# Altium project Terminal Shim Board.PrjPcb
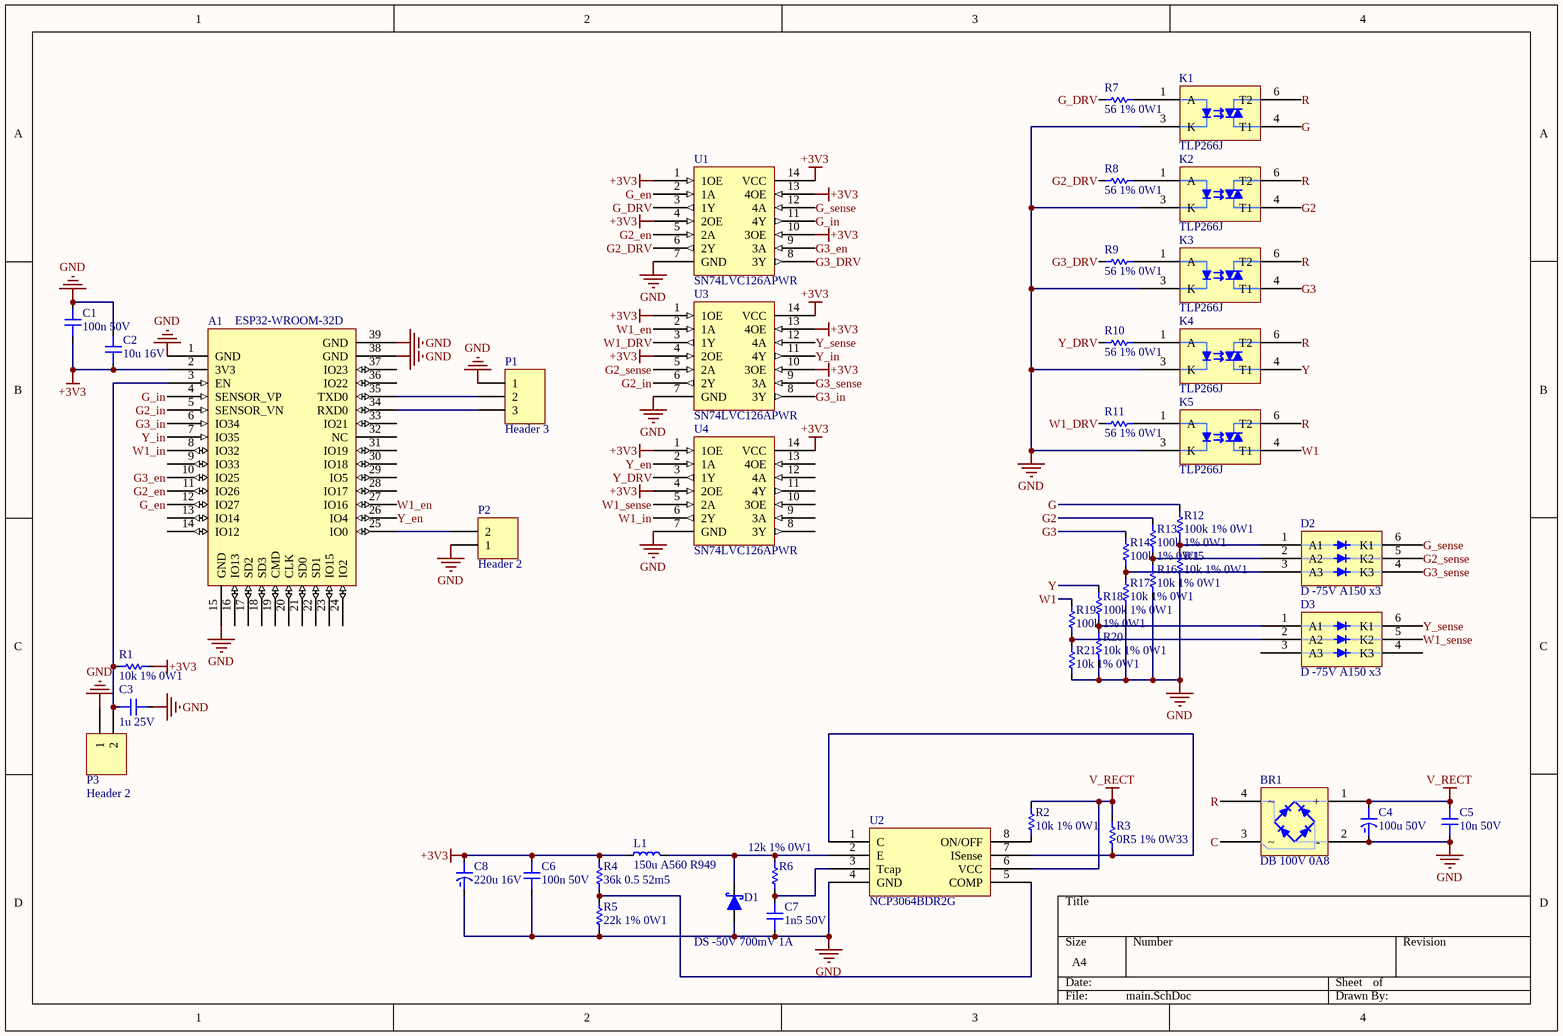
[diagram p0: main.SchDoc]
1 sheet, 47 parts. Net scope: strictly hierarchical (ports join the sheet entries above them; power ports are local).
Board file: main.PcbDoc

## Sheet main.SchDoc
size A4; SheetNumber: 1; SheetTotal: 1

### Parts
A1  ESP32-WROOM-32D  [ESP32-WROOM-32D]
BR1  DB 100V 0A8  [miniDIP 4]
C1  100n 50V  [CAP 0603 HD]
C2  10u 16V  [CAP 0805 LD]
C3  1u 25V  [CAP 0603 MD]
C4  100u 50V  [ELECTROLYTIC CAP D8 Lifted]
C5  10n 50V  [CAP 0603 HD]
C6  100n 50V  [CAP 0603 HD]
C7  1n5 50V  [CAP 0603 HD]
C8  220u 16V  [ELECTROLYTIC CAP D6.3 Lifted]
D1  DS -50V 700mV 1A  [DO-214AC]
D2  D -75V A150 x3  [SOT-363]
D3  D -75V A150 x3  [SOT-363]
K1  TLP266J  [11-4M1S MD]
K2  TLP266J  [11-4M1S MD]
K3  TLP266J  [11-4M1S MD]
K4  TLP266J  [11-4M1S MD]
K5  TLP266J  [11-4M1S MD]
L1  150u A560 R949  [IND 5050X45 MD]
P1  Header 3  [HDR1X3]
P2  Header 2  [HDR1X2]
P3  Header 2  [HDR1X2]
R1  10k 1% 0W1  [RES 0603 MD]
R2  10k 1% 0W1  [RES 0603 MD]
R3  0R5 1% 0W33  [RES 0805 HD]
R4  36k 0.5 52m5  [RES 0603 HD]
R5  22k 1% 0W1  [RES 0603 HD]
R6  12k 1% 0W1  [RES 0603 HD]
R7  56 1% 0W1  [RES 0603 HD]
R8  56 1% 0W1  [RES 0603 HD]
R9  56 1% 0W1  [RES 0603 HD]
R10  56 1% 0W1  [RES 0603 HD]
R11  56 1% 0W1  [RES 0603 HD]
R12  100k 1% 0W1  [RES 0603 HD]
R13  100k 1% 0W1  [RES 0603 HD]
R14  100k 1% 0W1  [RES 0603 HD]
R15  10k 1% 0W1  [RES 0603 HD]
R16  10k 1% 0W1  [RES 0603 HD]
R17  10k 1% 0W1  [RES 0603 HD]
R18  100k 1% 0W1  [RES 0603 HD]
R19  100k 1% 0W1  [RES 0603 HD]
R20  10k 1% 0W1  [RES 0603 HD]
R21  10k 1% 0W1  [RES 0603 HD]
U1  SN74LVC126APWR  [TSSOP-14 MD]
U2  NCP3064BDR2G  [soic-8 md]
U3  SN74LVC126APWR  [TSSOP-14 MD]
U4  SN74LVC126APWR  [TSSOP-14 MD]

### Nets
+3V3: A1.2(3V3) C1.1 C2.1 C6.2 C8.2 L1.1 R1.2 R4.2 U1.1(1OE) U1.4(2OE) U1.10(3OE) U1.13(4OE) U1.14(VCC) U3.1(1OE) U3.4(2OE) U3.10(3OE) U3.13(4OE) U3.14(VCC) U4.1(1OE) U4.4(2OE) U4.14(VCC)
GND: A1.1(GND) A1.15(GND) A1.38(GND) A1.39(GND) BR1.2(-) C1.2 C2.2 C3.2 C4.1 C5.1 C6.1 C7.1 C8.1 D1.2 K1.3(K) K2.3(K) K3.3(K) K4.3(K) K5.3(K) P1.1 P2.1 P3.1 R5.1 R15.1 R16.1 R17.1 R20.1 R21.1 U1.7(GND) U2.4(GND) U3.7(GND) U4.7(GND)
V_RECT: BR1.1(+) C4.2 C5.2 R2.1 R3.2 U2.6(VCC)
C: BR1.3
G: K1.4(T1) R12.2
G2: K2.4(T1) R13.2
G2_DRV: R8.1 U1.6(2Y)
G2_en: A1.11(IO26) U1.5(2A)
G2_in: A1.5(SENSOR_VN) U3.6(2Y)
G2_sense: D2.5(K2) U3.5(2A)
G3: K3.4(T1) R14.2
G3_DRV: R9.1 U1.8(3Y)
G3_en: A1.10(IO25) U1.9(3A)
G3_in: A1.6(IO34) U3.8(3Y)
G3_sense: D2.4(K3) U3.9(3A)
G_DRV: R7.1 U1.3(1Y)
G_en: A1.12(IO27) U1.2(1A)
G_in: A1.4(SENSOR_VP) U1.11(4Y)
G_sense: D2.6(K1) U1.12(4A)
R: BR1.4 K1.6(T2) K2.6(T2) K3.6(T2) K4.6(T2) K5.6(T2)
W1: K5.4(T1) R19.2
W1_DRV: R11.1 U3.3(1Y)
W1_en: A1.27(IO16) U3.2(1A)
W1_in: A1.8(IO32) U4.6(2Y)
W1_sense: D3.5(K2) U4.5(2A)
Y: K4.4(T1) R18.2
Y_DRV: R10.1 U4.3(1Y)
Y_en: A1.26(IO4) U4.2(1A)
Y_in: A1.7(IO35) U3.11(4Y)
Y_sense: D3.6(K1) U3.12(4A)
NetA1_3: A1.3(EN) C3.1 P3.2 R1.1
NetA1_25: A1.25(IO0) P2.2
NetA1_34: A1.34(RXD0) P1.3
NetA1_35: A1.35(TXD0) P1.2
NetC7_2: C7.2 R6.1 U2.3(Tcap)
NetD1_1: D1.1 L1.2 R6.2 U2.2(E)
NetD2_1: D2.1(A1) R12.1 R15.2
NetD2_2: D2.2(A2) R13.1 R16.2
NetD2_3: D2.3(A3) R14.1 R17.2
NetD3_1: D3.1(A1) R18.1 R20.2
NetD3_2: D3.2(A2) R19.1 R21.2
NetK1_1: K1.1(A) R7.2
NetK2_1: K2.1(A) R8.2
NetK3_1: K3.1(A) R9.2
NetK4_1: K4.1(A) R10.2
NetK5_1: K5.1(A) R11.2
NetR2_2: R2.2 U2.8(ON/OFF)
NetR3_1: R3.1 U2.1(C) U2.7(ISense)
NetR4_1: R4.1 R5.2 U2.5(COMP)

Not connected (* = marked no-connect by the designer): A1 9(IO33) 13(IO14) 14(IO12) 16(IO13) 17(SD2) 18(SD3) 19(CMD) 20(CLK) 21(SD0) 22(SD1) 23(IO15) 24(IO2) 28(IO17) 29(IO5) 30(IO18) 31(IO19) 32(NC) 33(IO21) 36(IO22) 37(IO23); D3 3(A3) 4(K3); U4 8(3Y) 9(3A) 10(3OE) 11(4Y) 12(4A) 13(4OE)

### Library data of the parts
BR1 = DB 100V 0A8: Bridge Rectifier 100V 0.8A MiniDIP SMD4; Manufacturer 1: Diodes; Manufacturer Part Number 1: HD01-T; Max Surge Current: 30A; Forward Voltage: 1V; Max Reverse Current: 5uA; Forward Current: 400mA; Number of Elements: 1; Average Rectified Current: 800mA; Element Configuration: Single; Reverse Voltage (DC): 70V; Capacitance: 10pF; Supplier 1: Digi-Key; Supplier Part Number 1: HD01DICT-ND; RoHS: Yes; Category: Rectifier Diodes; Stock 1: 99228; Pricing 1: 1=0.45000, 10=0.36200, 100=0.24640, 500=0.18480, 1000=0.13860 (USD); Mount: Surface Mount; Case/Package: SMD/SMT; Number of Pins: 4; Contact Plating: Tin,Matte; Min Operating Temperature: -55°C; Max Operating Temperature: 150°C; Packaging: Tape and Reel; Package Quantity: 3000; Peak Non-Repetitive Surge Current: 30A; Max Repetitive Reverse Voltage (Vrrm): 100V; Max Forward Surge Current (Ifsm): 30A; Termination: SMD/SMT; Current Rating: 800mA; Voltage Rating (DC): 100V; Output Current: 800mA; Series: -; Length: 4.9mm; Width: 4mm; Height: 2.7mm; Radiation Hardening: No; REACH SVHC: No SVHC; Lead Free: Lead Free; RoHS Compliant: Yes; ComponentLink1URL: https://datasheet.ciiva.com/11196/ds17003-11196328.pdf?src-supplier=Avnet; ComponentLink1Description: https://datasheet.ciiva.com/11196/ds17003-11196328.pdf?src-supplier=Avnet; ComponentLink2URL: https://datasheet.ciiva.com/34302/1540412-34302391.pdf?src-supplier=Jameco; ComponentLink2Description: https://datasheet.ciiva.com/34302/1540412-34302391.pdf?src-supplier=Jameco; ComponentLink3URL: https://datasheet.ciiva.com/4433/ds17003-4433579.pdf?src-supplier=Mouser; ComponentLink3Description: https://datasheet.ciiva.com/4433/ds17003-4433579.pdf?src-supplier=Mouser; ComponentLink4URL: https://datasheet.ciiva.com/16583/ds17003-16583723.pdf?src-supplier=Avnet+Europe; ComponentLink4Description: https://datasheet.ciiva.com/16583/ds17003-16583723.pdf?src-supplier=Avnet+Europe; ComponentLink5URL: https://datasheet.ciiva.com/1175/ds17003-1175220.pdf?src-supplier=Element14; ComponentLink5Description: https://datasheet.ciiva.com/1175/ds17003-1175220.pdf?src-supplier=Element14; ComponentLink6URL: https://datasheet.ciiva.com/16358/ds17003-16358441.pdf?src-supplier=Future+Electronics; ComponentLink6Description: https://datasheet.ciiva.com/16358/ds17003-16358441.pdf?src-supplier=Future+Electronics; ComponentLink7URL: https://datasheet.ciiva.com/15224/getdatasheetpartid-142523-15224709.pdf?src-supplier=Verical; ComponentLink7Description: https://datasheet.ciiva.com/15224/getdatasheetpartid-142523-15224709.pdf?src-supplier=Verical
C1 C6 = CAP 100n 50V 0603: Cap Ceramic 0.1uF 50V X7R 20% SMD 0603 125°C Paper T/R; Manufacturer 1: Samsung; Manufacturer Part Number 1: CL10B104MB8NNNC; Capacitance: 100nF; Supplier 1: Digi-Key; Supplier Part Number 1: 1276-1941-1-ND; RoHS: Yes; Category: Ceramic Capacitors; Stock 1: 1516356; Pricing 1: 1=0.10000, 10=0.02900, 50=0.01600, 100=0.01310, 500=0.00938, 1000=0.00737 (USD); Mount: Surface Mount; Case/Package: 0603; Case Code (Metric): 1608; Case Code (Imperial): 0603; Min Operating Temperature: -55°C; Max Operating Temperature: 125°C; Package Quantity: 1; Packaging: Tape and Reel; Tolerance: 20%; Voltage Rating: 50V; Dielectric: X7R; Voltage Rating (DC): 50V; Series: CL; Construction: Flat; Length: 1.6mm; Width: 0.031inch; Height: 0.8mm; Thickness: 0.035inch; Depth: 0.8mm; Radiation Hardening: No; Lead Free: Lead Free; RoHS Compliant: Yes; ComponentLink1URL: https://datasheet.ciiva.com/25767/cl10b104mb8nnnc-25767970.pdf?src-supplier=Digi-Key; ComponentLink1Description: https://datasheet.ciiva.com/25767/cl10b104mb8nnnc-25767970.pdf?src-supplier=Digi-Key; ComponentLink2URL: https://datasheet.ciiva.com/16428/cl05b104kq5nnnc-16428855.pdf?src-supplier=Future+Electronics; ComponentLink2Description: https://datasheet.ciiva.com/16428/cl05b104kq5nnnc-16428855.pdf?src-supplier=Future+Electronics
C2 = CAP 10u 16V 0805: SAMSUNG ELECTRO-MECHANICS - CL21A106KOQNNNE - SMD Multilayer Ceramic Capacitor, 10 µF, 16 V, 0805 [2012 Metric], ± 10%, X5R, CL Series; Dielectric: X7R; Capacitance: 10uF; Supplier 1: Digi-Key; Manufacturer 1: Samsung; Manufacturer Part Number 1: CL21A106KOQNNNE; RoHS: Yes; Category: Ceramic Capacitors; Stock 1: 920017; Pricing 1: 1=0.11000, 10=0.07600, 50=0.04340, 100=0.03590, 500=0.02516, 1000=0.02083 (USD); Mount: Surface Mount; Case/Package: 0805; Case Code (Metric): 2012; Case Code (Imperial): 0805; Min Operating Temperature: -55°C; Max Operating Temperature: 85°C; Package Quantity: 1; Packaging: Tape and Reel; Tolerance: 10%; Voltage Rating (DC): 16V; Voltage: 16V; Length: 2mm; Height: 1.25mm; Width: 0.049inch; Thickness: 0.055inch; Depth: 1.25mm; Radiation Hardening: No; Lead Free: Lead Free; ComponentLink1URL: https://datasheet.ciiva.com/25798/cl21a106koqnnne-25798133.pdf?src-supplier=Digi-Key; ComponentLink1Description: https://datasheet.ciiva.com/25798/cl21a106koqnnne-25798133.pdf?src-supplier=Digi-Key; ComponentLink2URL: https://datasheet.ciiva.com/15216/getdatasheetpartid-358435-15216234.pdf?src-supplier=Verical; ComponentLink2Description: https://datasheet.ciiva.com/15216/getdatasheetpartid-358435-15216234.pdf?src-supplier=Verical; ComponentLink3URL: https://datasheet.ciiva.com/16740/cl05b104kq5nnnc-16740697.pdf?src-supplier=Future+Electronics; ComponentLink3Description: https://datasheet.ciiva.com/16740/cl05b104kq5nnnc-16740697.pdf?src-supplier=Future+Electronics; Supplier Part Number 1: 1276-1096-1-ND; Voltage Rating: 16V
C3 = CAP 1u 25V 0603: SAMSUNG ELECTRO-MECHANICS - CL10B105KA8NNNC - SMD Multilayer Ceramic Capacitor, 1 µF, 25 V, 0603 [1608 Metric], ± 10%, X7R, CL Series; Capacitance: 1uF; Supplier 1: Digi-Key; Manufacturer 1: Samsung; Manufacturer Part Number 1: CL10B105KA8NNNC; RoHS: Yes; Category: Ceramic Capacitors; Stock 1: 3430244; Pricing 1: 1=0.10000, 10=0.05100, 50=0.02780, 100=0.02260, 500=0.01618, 1000=0.01271 (USD); Mount: Surface Mount; Case/Package: 0603; Case Code (Metric): 1608; Case Code (Imperial): 0603; Contact Plating: Tin; Min Operating Temperature: -55°C; Max Operating Temperature: 125°C; Tolerance: 10%; Packaging: Tape and Reel; Voltage Rating: 25V; Package Quantity: 1; Dielectric: X7R; Voltage: 25V; Length: 1.6mm; Height: 0.8mm; Width: 0.031inch; Thickness: 0.035inch; Depth: 0.8mm; Radiation Hardening: No; ComponentLink1URL: https://datasheet.ciiva.com/16449/cl10b105ka8nnnc-16449544.pdf?src-supplier=Future+Electronics; ComponentLink1Description: https://datasheet.ciiva.com/16449/cl10b105ka8nnnc-16449544.pdf?src-supplier=Future+Electronics; ComponentLink2URL: https://datasheet.ciiva.com/15195/getdatasheetpartid-359554-15195726.pdf?src-supplier=Verical; ComponentLink2Description: https://datasheet.ciiva.com/15195/getdatasheetpartid-359554-15195726.pdf?src-supplier=Verical; Supplier Part Number 1: 1276-1184-1-ND
C4 = CAP-EL 100u 50V
C5 = CAP 10n 50V 0603: KEMET - C0603C103M5RACTU - SMD Multilayer Ceramic Capacitor, 10000 pF, 50 V, 0603 [1608 Metric], ± 20%, X7R, C Series KEMET; Capacitance: 10nF; Dissipation Factor: 2.5%; Supplier 1: Digi-Key; Manufacturer 1: KEMET; Manufacturer Part Number 1: C0603C103M5RACTU; RoHS: Yes; Category: Ceramic Capacitors; Stock 1: 456818; Pricing 1: 1=0.10000, 10=0.03300, 50=0.01820, 100=0.01480, 500=0.01058, 1000=0.00832 (USD); Mount: Surface Mount,PCB; Case/Package: 0603; Number of Pins: 2; Case Code (Imperial): 0603; Case Code (Metric): 1608; Dielectric Material: Ceramic; Min Operating Temperature: -55°C; Max Operating Temperature: 125°C; Package Quantity: 1; Tolerance: 20%; Packaging: Tape and Reel; Voltage Rating: 50V; Voltage Rating (DC): 50V; Dielectric: X7R; Termination: SMD/SMT; Length: 1.6mm; Height: 0.8mm; Width: 0.8mm; Lead Pitch: 0.7mm; Thickness: 0.034inch; Depth: 0.8mm; Radiation Hardening: No; REACH SVHC: No SVHC; ComponentLink1URL: https://datasheet.ciiva.com/7823/kem-c1002-x7r-smd-7823979.pdf?src-supplier=Element14; ComponentLink1Description: https://datasheet.ciiva.com/7823/kem-c1002-x7r-smd-7823979.pdf?src-supplier=Element14; ComponentLink2URL: https://datasheet.ciiva.com/7823/kem-c1002-x7r-smd-7823980.pdf?src-supplier=Element14; ComponentLink2Description: https://datasheet.ciiva.com/7823/kem-c1002-x7r-smd-7823980.pdf?src-supplier=Element14; Supplier Part Number 1: 399-7842-1-ND
C7 = CAP 1n5 50V 0603: Multilayer Ceramic Capacitors MLCC - SMD/SMT 50V 1500pF X7R 0603 10% Tol; Manufacturer 1: Kyocera AVX; Manufacturer Part Number 1: 06035C152KAT4A; Capacitance: 1.5nF; Supplier 1: Digi-Key; Supplier Part Number 1: 478-13035-1-ND; RoHS: Yes; Category: Ceramic Capacitors; Stock 1: 28742; Pricing 1: 1=0.10000, 10=0.07000, 50=0.03800, 100=0.03100, 500=0.02214, 1000=0.01739, 2500=0.01581, 5000=0.01455 (USD); Mount: Surface Mount; Case/Package: 0603; Number of Pins: 2; Case Code (Imperial): 0603; Case Code (Metric): 1608; Weight: 7.1E-05oz; Min Operating Temperature: -55°C; Max Operating Temperature: 125°C; Tolerance: 10%; Packaging: Tape and Reel; Voltage Rating (DC): 50V; Dielectric: X7R; Termination: SMD/SMT; Construction: Flat; Length: 1.6mm; Width: 0.81mm; Height: 0.9mm; Depth: 0.81mm; Radiation Hardening: No; RoHS Compliant: Yes; ComponentLink1URL: https://datasheet.ciiva.com/11537/cx7r-11537941.pdf?src-supplier=Avnet; ComponentLink1Description: https://datasheet.ciiva.com/11537/cx7r-11537941.pdf?src-supplier=Avnet; ComponentLink2URL: https://datasheet.ciiva.com/13266/cx7r-218113-13266958.pdf?src-supplier=Mouser; ComponentLink2Description: https://datasheet.ciiva.com/13266/cx7r-218113-13266958.pdf?src-supplier=Mouser
C8 = CAP-EL 220u 16V
D1 = DS -50V 700mV 1A: DIODE SCHOTTKY 50V 1A SMAE; Manufacturer 1: MCC; Manufacturer Part Number 1: SS15E-TP; Max Forward Surge Current (Ifsm): 30A; Max Reverse Current: 20mA; Supplier 1: Digi-Key; Supplier Part Number 1: SS15E-TPMSCT-ND; RoHS: Yes; Category: Rectifier Diodes; Stock 1: 2654; Pricing 1: 1=0.36000, 10=0.29600, 100=0.15680, 500=0.10312, 1000=0.07012, 2000=0.06325 (USD); Mount: Surface Mount; Number of Pins: 2; Min Operating Temperature: -55°C; Max Operating Temperature: 150°C; Package Quantity: 1; Packaging: Tape and Reel; Average Rectified Current: 1A; Forward Current: 1A; Max Repetitive Reverse Voltage (Vrrm): 50V; Forward Voltage: 700mV; Max Reverse Voltage (DC): 50V; Series: -; Lead Free: Lead Free; RoHS Compliant: Yes; ComponentLink1URL: https://datasheet.ciiva.com/912/ss12e-ss110esmae-912129.pdf?src-supplier=Digi-Key; ComponentLink1Description: https://datasheet.ciiva.com/912/ss12e-ss110esmae-912129.pdf?src-supplier=Digi-Key; ComponentLink2URL: https://datasheet.ciiva.com/912/ss12e-ss110esmae-912130.pdf?src-supplier=Digi-Key; ComponentLink2Description: https://datasheet.ciiva.com/912/ss12e-ss110esmae-912130.pdf?src-supplier=Digi-Key; ComponentLink3URL: https://datasheet.ciiva.com/912/ss12e-ss110esmae-912131.pdf?src-supplier=Digi-Key; ComponentLink3Description: https://datasheet.ciiva.com/912/ss12e-ss110esmae-912131.pdf?src-supplier=Digi-Key
D2 D3 = D -75V A150 x3: DIODE FS 100V 150MA SOT363; Manufacturer 1: Diodes; Manufacturer Part Number 1: BAS16TWQ-13R-F; Reverse Recovery Time: 4ns; Supplier 1: Digi-Key; Supplier Part Number 1: BAS16TWQ-13R-FDICT-ND; RoHS: Yes; Category: Rectifier Diodes; Stock 1: 12873; Pricing 1: 1=0.37000, 10=0.27500, 100=0.15600, 500=0.10328, 1000=0.07919, 2000=0.06886, 5000=0.06197 (USD); Mount: Surface Mount; Case/Package: SOT-363; Packaging: Tape and Reel; Average Rectified Current: 150mA; Max Reverse Voltage (DC): 100V; RoHS Compliant: Yes; ComponentLink1URL: http://www.mouser.com/ds/2/115/BAS16TWQ-923617.pdf?src-supplier=Mouser; ComponentLink1Description: http://www.mouser.com/ds/2/115/BAS16TWQ-923617.pdf?src-supplier=Mouser; ComponentLink2URL: https://www.diodes.com/assets/Datasheets/BAS16TWQ.pdf?src-supplier=Digi-Key; ComponentLink2Description: https://www.diodes.com/assets/Datasheets/BAS16TWQ.pdf?src-supplier=Digi-Key
K1-K5 = TLP266J: OPTOISOLATOR 3.75KV TRIAC 6SO 4L; Manufacturer 1: Toshiba; Manufacturer Part Number 1: TLP266J(T7-TPL,E; Number of Channels: 1; Nominal Input Voltage: 1.27V; Max Input Voltage: 1.4V; RMS Current (Irms): 70mA; Turn-On Delay Time: 30us; Hold Current: 600uA; Approvals: UL; Supplier 1: Digi-Key; Supplier Part Number 1: TLP266J(T7-TPLECT-ND; RoHS: No; Category: Uncategorized; Stock 1: 1517; Pricing 1: 1=0.92000, 10=0.59900, 100=0.39270, 1000=0.31005 (USD); Mount: Surface Mount; Case/Package: SMD/SMT; Number of Pins: 4; Min Operating Temperature: -40°C; Max Operating Temperature: 100°C; Packaging: Tape and Reel; Forward Voltage: 1.27V; Radiation Hardening: No; ComponentLink1URL: https://datasheet.ciiva.com/24075/tlp266j-datasheet-en-20140619-24075350.pdf?src-supplier=Digi-Key; ComponentLink1Description: https://datasheet.ciiva.com/24075/tlp266j-datasheet-en-20140619-24075350.pdf?src-supplier=Digi-Key; ComponentLink2URL: https://datasheet.ciiva.com/41848/tlp266j-datasheet-en-20150313-41848894.pdf?src-supplier=Digi-Key; ComponentLink2Description: https://datasheet.ciiva.com/41848/tlp266j-datasheet-en-20150313-41848894.pdf?src-supplier=Digi-Key; ComponentLink3URL: https://datasheet.ciiva.com/41848/tlp266j-datasheet-en-20150313-41848895.pdf?src-supplier=Digi-Key; ComponentLink3Description: https://datasheet.ciiva.com/41848/tlp266j-datasheet-en-20150313-41848895.pdf?src-supplier=Digi-Key; ComponentLink4URL: https://datasheet.ciiva.com/30015/tlp266j-datasheet-en-20150313-30015518.pdf?src-supplier=Avnet; ComponentLink4Description: https://datasheet.ciiva.com/30015/tlp266j-datasheet-en-20150313-30015518.pdf?src-supplier=Avnet
L1 = IND 150u 560mA: FIXED IND 150UH 610MA 949 MOHM; Manufacturer 1: TDK; Manufacturer Part Number 1: VLS5045EX-151M; Core Material: Ferrite; Tolerance: 20%; Saturation Current: 560mA; Shielding: Shielded; DC Resistance (DCR): 949mR; Test Frequency: 100kHz; Supplier 1: Digi-Key; Supplier Part Number 1: 445-174857-1-ND; RoHS: Yes; Stock 1: 800; Pricing 1: 1=0.46000, 10=0.40400, 25=0.37520, 50=0.31760, 100=0.28880, 250=0.27144, 500=0.24256 (USD); Mount: Surface Mount; Case/Package: Nonstandard; Min Operating Temperature: -40°C; Max Operating Temperature: 105°C; Resistor Type: Wirewound; Packaging: Tape and Reel; Inductance: 150uH; Current Rating: 610mA; RoHS Compliant: Yes; ComponentLink1URL: https://media.digikey.com/pdf/Data%20Sheets/TDK%20PDFs/VLS-EX_Series_Br.pdf?src-supplier=Digi-Key; ComponentLink1Description: https://media.digikey.com/pdf/Data%20Sheets/TDK%20PDFs/VLS-EX_Series_Br.pdf?src-supplier=Digi-Key; ComponentLink2URL: https://product.tdk.com/info/en/catalog/datasheets/inductor_commercial_power_vls5045ex_en.pdf?src-supplier=Digi-Key; ComponentLink2Description: https://product.tdk.com/info/en/catalog/datasheets/inductor_commercial_power_vls5045ex_en.pdf?src-supplier=Digi-Key
P1 = Header 3: Header, 3-Pin; LatestRevisionDate: 17-Jul-2002; LatestRevisionNote: Re-released for DXP Platform.; Publisher: Altium Limited
P2 P3 = Header 2: Header, 2-Pin; LatestRevisionDate: 17-Jul-2002; LatestRevisionNote: Re-released for DXP Platform.; Publisher: Altium Limited
R1 R2 R15-R17 R20 R21 = RES 10k 0603 1% 0W1: PANASONIC - ERJ-3EKF1002V. - THICK FILM CHIP RES, 0603, 1%, PRECISION; Resistance: 10kR; Power Rating: 100mW; Voltage Rating: 75V; Temperature Coefficient: 100ppm/°C; Supplier 1: Digi-Key; Manufacturer 1: Panasonic; Manufacturer Part Number 1: ERJ-3EKF1002V; RoHS: Yes; Category: Chip SMD Resistors; Stock 1: 4395630; Pricing 1: 1=0.10000, 10=0.03700, 100=0.01490, 1000=0.00670, 2500=0.00582 (USD); Mount: Surface Mount; Case/Package: 0603; Number of Pins: 2; Case Code (Metric): 1608; Case Code (Imperial): 0603; Contact Plating: Tin; Size Code: 0603; Min Operating Temperature: -55°C; Max Operating Temperature: 155°C; Tolerance: 1%; Packaging: Tape and Reel; Package Quantity: 1; Resistor Type: Thick Film; Number of Terminations: 2; Termination: SMD/SMT; Max Power Dissipation: 100mW; Voltage Rating (DC): 75V; Features: Automotive AEC-Q200; Series: ERJ; Resistance Tolerance: 1%; Construction: Rectangular; Technology: THICK FILM; Length: 1.6mm; Width: 0.031inch; Height: 0.45mm; Depth: 0.8mm; Radiation Hardening: No; REACH SVHC: No SVHC; Military Standard: Not; Lead Free: Lead Free; RoHS Compliant: Yes; ComponentLink1URL: https://datasheet.ciiva.com/48530/aoa0000ce2-48530988.pdf?src-supplier=Avnet; ComponentLink1Description: https://datasheet.ciiva.com/48530/aoa0000ce2-48530988.pdf?src-supplier=Avnet; ComponentLink2URL: https://datasheet.ciiva.com/24070/aoa0000ce2-24070318.pdf?src-supplier=Mouser; ComponentLink2Description: https://datasheet.ciiva.com/24070/aoa0000ce2-24070318.pdf?src-supplier=Mouser; ComponentLink3URL: https://datasheet.ciiva.com/9194/aoa0000ce2-9194199.pdf?src-supplier=Avnet; ComponentLink3Description: https://datasheet.ciiva.com/9194/aoa0000ce2-9194199.pdf?src-supplier=Avnet; Supplier Part Number 1: P10.0KHCT-ND
R3 = RES 0R5 0805 1% 0W33: SUSUMU         RL1220S-R50-F             SMD Current Sense Resistor, 0.5 ohm, 0805 [2012 Metric], 250 mW,  1%, RL Series; Resistance: 500mR; Power Rating: 250mW; Temperature Coefficient: 200ppm/°C; Max Power Dissipation: 333mW; Voltage Rating (DC): 100V; Supplier 1: Digi-Key; Supplier Part Number 1: RL12S.50FCT-ND; Manufacturer 1: Susumu; Manufacturer Part Number 1: RL1220S-R50-F; RoHS: No; Category: Chip SMD Resistors; Stock 1: 56487; Pricing 1: 1=0.29000, 10=0.24300, 25=0.17640, 50=0.12780, 100=0.09480, 250=0.07276, 500=0.05732, 1000=0.03969 (USD); Case/Package: 0805; Number of Pins: 2; Case Code (Metric): 2012; Case Code (Imperial): 0805; Weight: 0.000194oz; Size Code: 0805; Min Operating Temperature: -55°C; Max Operating Temperature: 125°C; Package Quantity: 1; Tolerance: 1%; Packaging: Tape and Reel; Resistor Type: Thin Film; Number of Terminations: 2; Termination: SMD/SMT; Series: RL; Technology: THIN FILM; Resistance Tolerance: 1%; Length: 0.079inch; Width: 0.049inch; Height: 0.02inch; REACH SVHC: Unknown; Lead Free: Lead Free; ComponentLink1URL: https://datasheet.ciiva.com/2487/rl-data-sheet-2487714.pdf?src-supplier=Digi-Key; ComponentLink1Description: https://datasheet.ciiva.com/2487/rl-data-sheet-2487714.pdf?src-supplier=Digi-Key; ComponentLink2URL: https://datasheet.ciiva.com/2487/rl-data-sheet-2487715.pdf?src-supplier=Digi-Key; ComponentLink2Description: https://datasheet.ciiva.com/2487/rl-data-sheet-2487715.pdf?src-supplier=Digi-Key; ComponentLink3URL: https://datasheet.ciiva.com/2487/rl-data-sheet-2487716.pdf?src-supplier=Digi-Key; ComponentLink3Description: https://datasheet.ciiva.com/2487/rl-data-sheet-2487716.pdf?src-supplier=Digi-Key; ComponentLink4URL: https://datasheet.ciiva.com/12837/e-15-16-12837656.pdf?src-supplier=Mouser; ComponentLink4Description: https://datasheet.ciiva.com/12837/e-15-16-12837656.pdf?src-supplier=Mouser; ComponentLink5URL: https://datasheet.ciiva.com/7984/87305-7984266.pdf?src-supplier=Element14; ComponentLink5Description: https://datasheet.ciiva.com/7984/87305-7984266.pdf?src-supplier=Element14
R4 = RES 36k 0603 0%5 62m5: RES SMD 36K OHM 0.5% 1/16W 0603; Manufacturer 1: Susumu; Manufacturer Part Number 1: RR0816P-363-D; Resistance: 36kR; Power Rating: 62.5mW; Voltage Rating: 75V; Temperature Coefficient: 25ppm/°C; Max Power Dissipation: 63mW; Supplier 1: Digi-Key; RoHS: Yes; Category: Chip SMD Resistors; Stock 1: 20789; Pricing 1: 1=0.10000, 10=0.08500, 100=0.03260, 1000=0.01432, 2500=0.01237 (USD); Mount: Surface Mount; Case/Package: 0603; Number of Pins: 2; Case Code (Metric): 1608; Case Code (Imperial): 0603; Min Operating Temperature: -55°C; Max Operating Temperature: 125°C; Tolerance: 0.5%; Packaging: Tape and Reel; Package Quantity: 1; Termination: SMD/SMT; Resistor Type: Thin Film; Number of Terminations: 2; Voltage Rating (DC): 75V; Length: 0.063inch; Height: 0.4mm; Width: 0.032inch; Depth: 0.8mm; Height - Seated (Max): 0.02inch; Lead Free: Lead Free; ComponentLink1URL: https://datasheet.ciiva.com/11820/0900766b80808d64-11820413.pdf?src-supplier=RSComponents; ComponentLink1Description: https://datasheet.ciiva.com/11820/0900766b80808d64-11820413.pdf?src-supplier=RSComponents; ComponentLink2URL: https://datasheet.ciiva.com/2487/rr-data-sheet-2487307.pdf?src-supplier=Digi-Key; ComponentLink2Description: https://datasheet.ciiva.com/2487/rr-data-sheet-2487307.pdf?src-supplier=Digi-Key; ComponentLink3URL: https://datasheet.ciiva.com/2487/rr-data-sheet-2487308.pdf?src-supplier=Digi-Key; ComponentLink3Description: https://datasheet.ciiva.com/2487/rr-data-sheet-2487308.pdf?src-supplier=Digi-Key; ComponentLink4URL: https://datasheet.ciiva.com/2487/rr-data-sheet-2487309.pdf?src-supplier=Digi-Key; ComponentLink4Description: https://datasheet.ciiva.com/2487/rr-data-sheet-2487309.pdf?src-supplier=Digi-Key; Supplier Part Number 1: RR08P36.0KDCT-ND
R5 = RES 22k 0603 1% 0W1: Res Thick Film 0603 22K Ohm 1% 1/10W 100ppm/C Molded SMD SMD Paper T/R; Manufacturer 1: Stackpole Electronics; Manufacturer Part Number 1: RMCF0603FG22K0; Resistance: 22kR; Max Power Dissipation: 100mW; Temperature Coefficient: 100ppm/°C; Supplier 1: Digi-Key; Supplier Part Number 1: RMCF0603FG22K0CT-ND; RoHS: Yes; Category: Chip SMD Resistors; Stock 1: 6; Pricing 1: 1=0.10000, 10=0.01700, 100=0.00680, 1000=0.00305, 2500=0.00264, 5000=0.00218 (USD); Mount: Surface Mount; Case/Package: 0603; Case Code (Metric): 1608; Case Code (Imperial): 0603; Contact Plating: Tin,Matte; Min Operating Temperature: -55°C; Max Operating Temperature: 155°C; Packaging: Tape and Reel; Tolerance: 1%; Resistor Type: Thick Film; Number of Terminations: 2; Features: Automotive AEC-Q200; Series: RMCF; Length: 0.061inch; Width: 0.031inch; Height: 0.022inch; Radiation Hardening: No; RoHS Compliant: Yes; ComponentLink1URL: https://www.seielect.com/catalog/SEI-RMCF_RMCP.pdf?src-supplier=Avnet; ComponentLink1Description: https://www.seielect.com/catalog/SEI-RMCF_RMCP.pdf?src-supplier=Avnet; ComponentLink2URL: https://www.seielect.com/catalog/SEI-Packaging.pdf?src-supplier=Digi-Key; ComponentLink2Description: https://www.seielect.com/catalog/SEI-Packaging.pdf?src-supplier=Digi-Key; ComponentLink3URL: https://www.seielect.com/Catalog/SEI-RMCF_RMCP.pdf?src-supplier=Digi-Key; ComponentLink3Description: https://www.seielect.com/Catalog/SEI-RMCF_RMCP.pdf?src-supplier=Digi-Key
R6 = RES 12k 0603 1% 0W1: TE CONNECTIVITY - CRGCQ0603F12K - SMD Chip Resistor, 0603 [1608 Metric], 12 kohm, CRGCQ Series, 75 V, Thick Film, 100 mW; Supplier 1: Digi-Key; Supplier Part Number 1: A129701CT-ND; Manufacturer 1: TE Connectivity; Manufacturer Part Number 1: CRGCQ0603F12K; RoHS: Yes; Category: Chip SMD Resistors; Stock 1: 77509; Pricing 1: 1=0.10000, 10=0.03100, 100=0.01260, 1000=0.00564, 2500=0.00489 (USD); RoHS Compliant: Yes; ComponentLink1URL: https://4donline.ihs.com/images/VipMasterIC/IC/TYEL/TYEL-S-A0004929575/TYEL-S-A0004929575-1.pdf?hkey=52A5661711E402568146F3353EA87419&src-supplier=Farnell; ComponentLink1Description: https://4donline.ihs.com/images/VipMasterIC/IC/TYEL/TYEL-S-A0004929575/TYEL-S-A0004929575-1.pdf?hkey=52A5661711E402568146F3353EA87419&src-supplier=Farnell; ComponentLink2URL: https://4donline.ihs.com/images/VipMasterIC/IC/TYEL/TYEL-S-A0004929575/TYEL-S-A0004929575-1.pdf?hkey=52A5661711E402568146F3353EA87419&src-supplier=Element14; ComponentLink2Description: https://4donline.ihs.com/images/VipMasterIC/IC/TYEL/TYEL-S-A0004929575/TYEL-S-A0004929575-1.pdf?hkey=52A5661711E402568146F3353EA87419&src-supplier=Element14; ComponentLink3URL: https://4donline.ihs.com/images/VipMasterIC/IC/TYEL/TYEL-S-A0004929575/TYEL-S-A0004929575-1.pdf?hkey=52A5661711E402568146F3353EA87419&src-supplier=Newark; ComponentLink3Description: https://4donline.ihs.com/images/VipMasterIC/IC/TYEL/TYEL-S-A0004929575/TYEL-S-A0004929575-1.pdf?hkey=52A5661711E402568146F3353EA87419&src-supplier=Newark
R7-R11 = RES 56 0603 1% 0W1: TE CONNECTIVITY - CRGCQ0603F56R - SMD Chip Resistor, 0603 [1608 Metric], 56 ohm, CRGCQ Series, 75 V, Thick Film, 100 mW; Supplier 1: Digi-Key; Supplier Part Number 1: A129673CT-ND; Manufacturer 1: TE Connectivity; Manufacturer Part Number 1: CRGCQ0603F56R; RoHS: Yes; Category: Chip SMD Resistors; Stock 1: 13276; Pricing 1: 1=0.10000, 10=0.03500, 100=0.01420, 1000=0.00637, 2500=0.00553 (USD); RoHS Compliant: Yes; ComponentLink1URL: https://4donline.ihs.com/images/VipMasterIC/IC/TYEL/TYEL-S-A0004929575/TYEL-S-A0004929575-1.pdf?hkey=52A5661711E402568146F3353EA87419&src-supplier=Farnell; ComponentLink1Description: https://4donline.ihs.com/images/VipMasterIC/IC/TYEL/TYEL-S-A0004929575/TYEL-S-A0004929575-1.pdf?hkey=52A5661711E402568146F3353EA87419&src-supplier=Farnell; ComponentLink2URL: https://4donline.ihs.com/images/VipMasterIC/IC/TYEL/TYEL-S-A0004929575/TYEL-S-A0004929575-1.pdf?hkey=52A5661711E402568146F3353EA87419&src-supplier=Newark; ComponentLink2Description: https://4donline.ihs.com/images/VipMasterIC/IC/TYEL/TYEL-S-A0004929575/TYEL-S-A0004929575-1.pdf?hkey=52A5661711E402568146F3353EA87419&src-supplier=Newark
R12-R14 R18 R19 = RES 100k 0603 1% 0W1: RES 100K OHM 1% 1/10W 0603; Manufacturer 1: Stackpole Electronics; Manufacturer Part Number 1: RMCF0603FT100K; Resistance: 100kR; Power Rating: 100mW; Temperature Coefficient: 100ppm/°C; Working Voltage: 75V; Supplier 1: Digi-Key; Supplier Part Number 1: RMCF0603FT100KCT-ND; RoHS: Yes; Category: Chip SMD Resistors; Stock 1: 4387; Pricing 1: 1=0.10000, 10=0.01700, 100=0.00680, 1000=0.00305, 2500=0.00264 (USD); Mount: Surface Mount; Case/Package: 0603; Case Code (Metric): 1608; Case Code (Imperial): 0603; Contact Plating: Tin,Matte; Min Operating Temperature: -55°C; Max Operating Temperature: 155°C; Packaging: Tape and Reel; Series: RMCF; Tolerance: 1%; Resistor Type: Thick Film; Number of Terminations: 2; Max Power Dissipation: 100mW; Features: Automotive AEC-Q200; Construction: Rectangular; Length: 1.55mm; Width: 0.031inch; Height: 0.022inch; Depth: 0.8mm; Radiation Hardening: No; Military Standard: Not; Lead Free: Lead Free; RoHS Compliant: Yes; ComponentLink1URL: https://datasheet.ciiva.com/15193/getdatasheetpartid-362597-15193437.pdf?src-supplier=Verical; ComponentLink1Description: https://datasheet.ciiva.com/15193/getdatasheetpartid-362597-15193437.pdf?src-supplier=Verical
U1 U3 U4 = SN74LVC126APWR: TEXAS INSTRUMENTS - SN74LVC126APWR - NON INVERTING BUS BUFFER GATE TSSOP14; Number of Channels: 4; Max Supply Voltage: 3.6V; Min Supply Voltage: 1.65V; Propagation Delay: 4.5ns; Logic Function: Buffer,Inverting; Max Power Dissipation: 500mW; Number of Bits per Element: 1; High Level Output Current: -24mA; Low Level Output Current: 24mA; Number of Output Lines: 3; Polarity: Non-Inverting; Turn-On Delay Time: 14.1ns; Quiescent Current: 1uA; Supplier 1: Digi-Key; Supplier Part Number 1: 296-8458-1-ND; Manufacturer 1: Texas Instruments; Manufacturer Part Number 1: SN74LVC126APWR; RoHS: Yes; Category: Buffers, Drivers and Transceivers; Stock 1: 1147; Pricing 1: 1=0.41000, 10=0.32900, 25=0.30080, 100=0.22390, 250=0.20288, 500=0.16790, 1000=0.12593 (USD); Mount: Surface Mount; Case/Package: TSSOP; Number of Pins: 14; Min Operating Temperature: -40°C; Max Operating Temperature: 125°C; Number of Inputs: 4; Number of Outputs: 4; Packaging: Tape and Reel; Package Quantity: 1; Number of Elements: 4; Number of Input Lines: 4; Number of Circuits: 4; Number of Bits: 4; Length: 5mm; Width: 4.4mm; Height: 1.15mm; Radiation Hardening: No; REACH SVHC: No SVHC; Lead Free: Lead Free; RoHS Compliant: Yes; ComponentLink1URL: https://datasheet.ciiva.com/14301/sn74lvc126a-14301088.pdf?src-supplier=Avnet; ComponentLink1Description: https://datasheet.ciiva.com/14301/sn74lvc126a-14301088.pdf?src-supplier=Avnet; ComponentLink2URL: https://datasheet.ciiva.com/41456/001017109-da-01-en-ic-bus-buf-q-sn74lvc126apwr-tssop-14-tid-41456102.pdf?src-supplier=Conrad; ComponentLink2Description: https://datasheet.ciiva.com/41456/001017109-da-01-en-ic-bus-buf-q-sn74lvc126apwr-tssop-14-tid-41456102.pdf?src-supplier=Conrad; ComponentLink3URL: https://datasheet.ciiva.com/1833/sn74lvc126a-1833685.pdf?src-supplier=Digi-Key; ComponentLink3Description: https://datasheet.ciiva.com/1833/sn74lvc126a-1833685.pdf?src-supplier=Digi-Key; ComponentLink4URL: https://datasheet.ciiva.com/1833/sn74lvc126a-1833686.pdf?src-supplier=Digi-Key; ComponentLink4Description: https://datasheet.ciiva.com/1833/sn74lvc126a-1833686.pdf?src-supplier=Digi-Key; ComponentLink5URL: https://datasheet.ciiva.com/1833/sn74lvc126a-1833687.pdf?src-supplier=Digi-Key; ComponentLink5Description: https://datasheet.ciiva.com/1833/sn74lvc126a-1833687.pdf?src-supplier=Digi-Key; ComponentLink6URL: https://datasheet.ciiva.com/14301/scas339q-14301885.pdf?src-supplier=Avnet; ComponentLink6Description: https://datasheet.ciiva.com/14301/scas339q-14301885.pdf?src-supplier=Avnet; ComponentLink7URL: https://datasheet.ciiva.com/7795/sn74lvc126a-7795061.pdf?src-supplier=Element14; ComponentLink7Description: https://datasheet.ciiva.com/7795/sn74lvc126a-7795061.pdf?src-supplier=Element14; ComponentLink8URL: https://datasheet.ciiva.com/46442/1834151-46442054.pdf?src-supplier=Element14; ComponentLink8Description: https://datasheet.ciiva.com/46442/1834151-46442054.pdf?src-supplier=Element14; ComponentLink9URL: https://datasheet.ciiva.com/46442/1705147-46442085.pdf?src-supplier=Element14; ComponentLink9Description: https://datasheet.ciiva.com/46442/1705147-46442085.pdf?src-supplier=Element14
U2 = NCP3064BDR2G: ON SEMICONDUCTOR         NCP3064BDR2G             DC-DC Switching Buck, Boost, Inverting Regulator, Adj., 3V-40Vin, 1.25V-40V/1.5A out, 150kHz, SOIC-8; Number of Outputs: 1; Min Input Voltage: 3V; Max Input Voltage: 40V; Efficiency: 86%; Max Output Current: 1.5A; Synchronous Rectifier: No; Min Output Voltage: 1.25V; Output Type: Adjustable; Switching Frequency-Max: 190kHz; Supplier 1: Digi-Key; Supplier Part Number 1: NCP3064BDR2GOSCT-ND; Manufacturer 1: ON Semiconductor; Manufacturer Part Number 1: NCP3064BDR2G; RoHS: Yes; Category: Voltage Regulators - Switching; Stock 1: 1017; Pricing 1: 1=1.29000, 10=1.15700, 25=1.09800, 100=0.90180, 250=0.84300, 500=0.74498, 1000=0.64732 (USD); Mount: Surface Mount; Case/Package: SOIC; Number of Pins: 8; Min Operating Temperature: -40°C; Max Operating Temperature: 70°C; Package Quantity: 1; Packaging: Tape and Reel; Output Current: 1.5A; Switching Frequency: 150kHz; Output Voltage: 40V; Max Output Voltage: 40V; Operating Supply Voltage: 40V; Series: -; Length: 5mm; Width: 4mm; Height: 1.5mm; Radiation Hardening: No; REACH SVHC: No SVHC; Lead Free: Lead Free; Halogen Free: Halogen Free; RoHS Compliant: Yes; ComponentLink1URL: https://datasheet.ciiva.com/2025/ncp3064-d-2025232.pdf?src-supplier=Digi-Key; ComponentLink1Description: https://datasheet.ciiva.com/2025/ncp3064-d-2025232.pdf?src-supplier=Digi-Key; ComponentLink2URL: https://datasheet.ciiva.com/26896/ncp3064bdr2g-26896036.pdf?src-supplier=IIIC; ComponentLink2Description: https://datasheet.ciiva.com/26896/ncp3064bdr2g-26896036.pdf?src-supplier=IIIC; ComponentLink3URL: https://datasheet.ciiva.com/2025/ncp3064-d-2025231.pdf?src-supplier=Digi-Key; ComponentLink3Description: https://datasheet.ciiva.com/2025/ncp3064-d-2025231.pdf?src-supplier=Digi-Key; ComponentLink4URL: https://datasheet.ciiva.com/2025/ncp3064-d-2025233.pdf?src-supplier=Digi-Key; ComponentLink4Description: https://datasheet.ciiva.com/2025/ncp3064-d-2025233.pdf?src-supplier=Digi-Key; ComponentLink5URL: https://datasheet.ciiva.com/8270/ncp3064-d-8270220.pdf?src-supplier=Avnet; ComponentLink5Description: https://datasheet.ciiva.com/8270/ncp3064-d-8270220.pdf?src-supplier=Avnet